# Altium schematic sheet Z7_BANK_DDR3.SchDoc
size A3
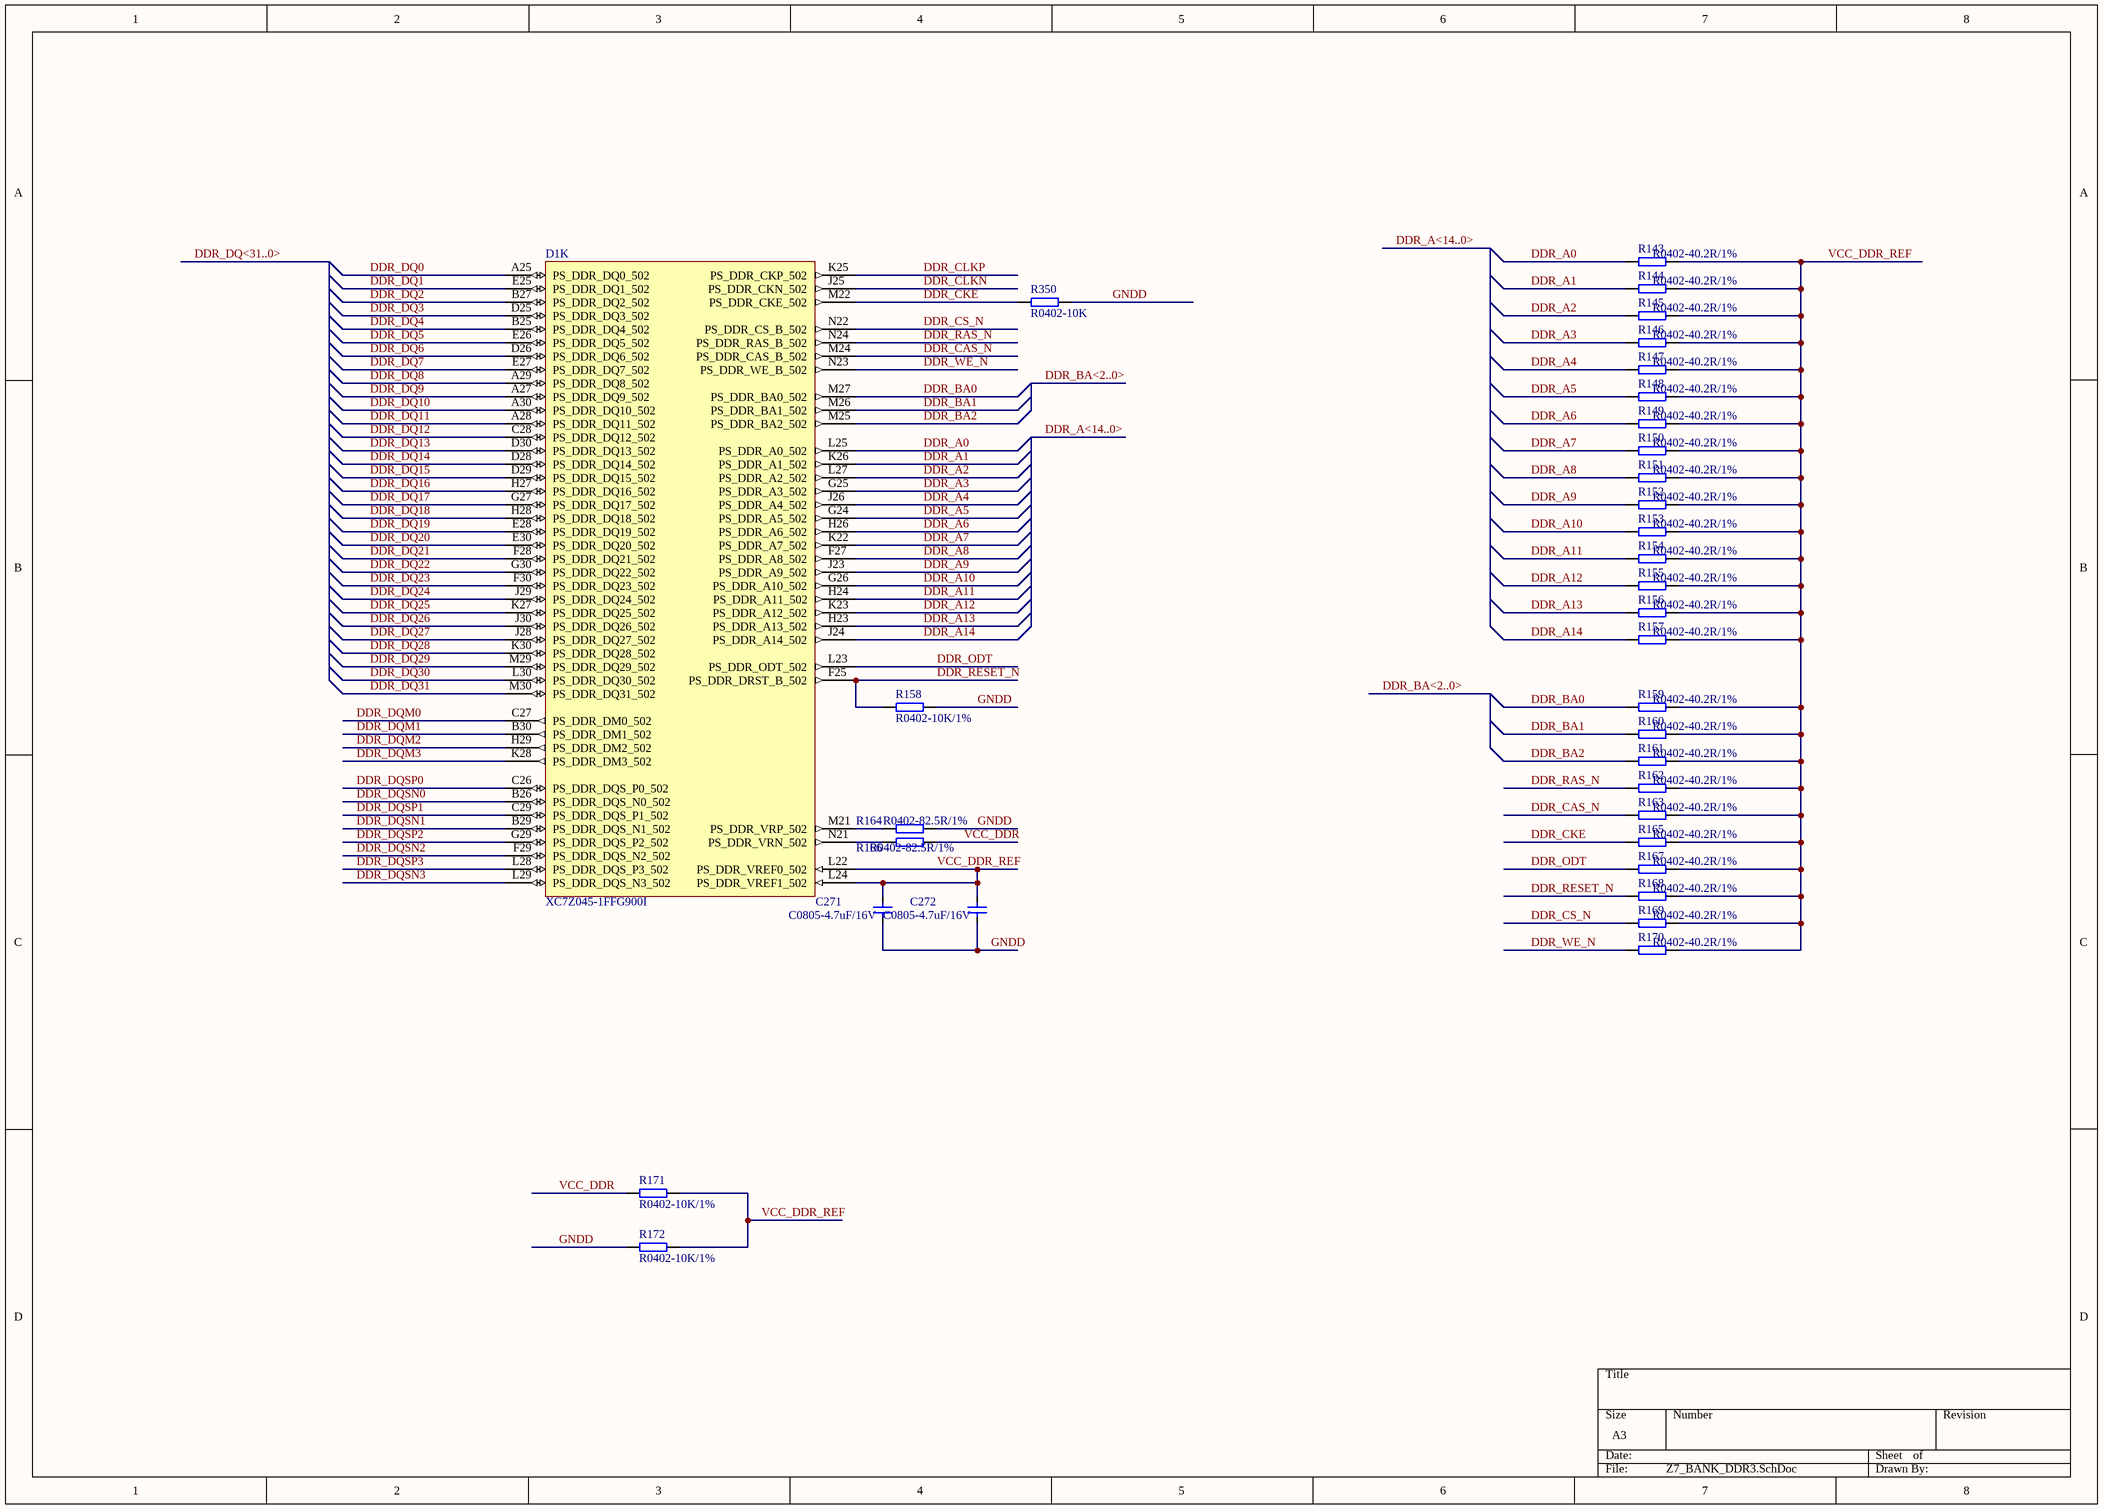
[diagram p0: Z7_BANK_DDR3.SchDoc]

## Parts
C271  C0805-4.7uF/16V  [C0805]
C272  C0805-4.7uF/16V  [C0805]
D1  XC7Z045-1FFG900I  [FFG900]  (part K of 16)
R143  R0402-40.2R/1%  [R0402]
R144  R0402-40.2R/1%  [R0402]
R145  R0402-40.2R/1%  [R0402]
R146  R0402-40.2R/1%  [R0402]
R147  R0402-40.2R/1%  [R0402]
R148  R0402-40.2R/1%  [R0402]
R149  R0402-40.2R/1%  [R0402]
R150  R0402-40.2R/1%  [R0402]
R151  R0402-40.2R/1%  [R0402]
R152  R0402-40.2R/1%  [R0402]
R153  R0402-40.2R/1%  [R0402]
R154  R0402-40.2R/1%  [R0402]
R155  R0402-40.2R/1%  [R0402]
R156  R0402-40.2R/1%  [R0402]
R157  R0402-40.2R/1%  [R0402]
R158  R0402-10K/1%  [R0402]
R159  R0402-40.2R/1%  [R0402]
R160  R0402-40.2R/1%  [R0402]
R161  R0402-40.2R/1%  [R0402]
R162  R0402-40.2R/1%  [R0402]
R163  R0402-40.2R/1%  [R0402]
R164  R0402-82.5R/1%  [R0402]
R165  R0402-40.2R/1%  [R0402]
R166  R0402-82.5R/1%  [R0402]
R167  R0402-40.2R/1%  [R0402]
R168  R0402-40.2R/1%  [R0402]
R169  R0402-40.2R/1%  [R0402]
R170  R0402-40.2R/1%  [R0402]
R171  R0402-10K/1%  [R0402]
R172  R0402-10K/1%  [R0402]
R350  R0402-10K  [R0402]

## Nets
DDR_A0: D1.L25(PS_DDR_A0_502) R143.1
DDR_A1: D1.K26(PS_DDR_A1_502) R144.1
DDR_A2: D1.L27(PS_DDR_A2_502) R145.1
DDR_A3: D1.G25(PS_DDR_A3_502) R146.1
DDR_A4: D1.J26(PS_DDR_A4_502) R147.1
DDR_A5: D1.G24(PS_DDR_A5_502) R148.1
DDR_A6: D1.H26(PS_DDR_A6_502) R149.1
DDR_A7: D1.K22(PS_DDR_A7_502) R150.1
DDR_A8: D1.F27(PS_DDR_A8_502) R151.1
DDR_A9: D1.J23(PS_DDR_A9_502) R152.1
DDR_A10: D1.G26(PS_DDR_A10_502) R153.1
DDR_A11: D1.H24(PS_DDR_A11_502) R154.1
DDR_A12: D1.K23(PS_DDR_A12_502) R155.1
DDR_A13: D1.H23(PS_DDR_A13_502) R156.1
DDR_A14: D1.J24(PS_DDR_A14_502) R157.1
DDR_BA0: D1.M27(PS_DDR_BA0_502) R159.1
DDR_BA1: D1.M26(PS_DDR_BA1_502) R160.1
DDR_BA2: D1.M25(PS_DDR_BA2_502) R161.1
DDR_CAS_N: D1.M24(PS_DDR_CAS_B_502) R163.1
DDR_CKE: D1.M22(PS_DDR_CKE_502) R165.1 R350.2
DDR_CLKN: D1.J25(PS_DDR_CKN_502)
DDR_CLKP: D1.K25(PS_DDR_CKP_502)
DDR_CS_N: D1.N22(PS_DDR_CS_B_502) R169.1
DDR_DQ0: D1.A25(PS_DDR_DQ0_502)
DDR_DQ1: D1.E25(PS_DDR_DQ1_502)
DDR_DQ2: D1.B27(PS_DDR_DQ2_502)
DDR_DQ3: D1.D25(PS_DDR_DQ3_502)
DDR_DQ4: D1.B25(PS_DDR_DQ4_502)
DDR_DQ5: D1.E26(PS_DDR_DQ5_502)
DDR_DQ6: D1.D26(PS_DDR_DQ6_502)
DDR_DQ7: D1.E27(PS_DDR_DQ7_502)
DDR_DQ8: D1.A29(PS_DDR_DQ8_502)
DDR_DQ9: D1.A27(PS_DDR_DQ9_502)
DDR_DQ10: D1.A30(PS_DDR_DQ10_502)
DDR_DQ11: D1.A28(PS_DDR_DQ11_502)
DDR_DQ12: D1.C28(PS_DDR_DQ12_502)
DDR_DQ13: D1.D30(PS_DDR_DQ13_502)
DDR_DQ14: D1.D28(PS_DDR_DQ14_502)
DDR_DQ15: D1.D29(PS_DDR_DQ15_502)
DDR_DQ16: D1.H27(PS_DDR_DQ16_502)
DDR_DQ17: D1.G27(PS_DDR_DQ17_502)
DDR_DQ18: D1.H28(PS_DDR_DQ18_502)
DDR_DQ19: D1.E28(PS_DDR_DQ19_502)
DDR_DQ20: D1.E30(PS_DDR_DQ20_502)
DDR_DQ21: D1.F28(PS_DDR_DQ21_502)
DDR_DQ22: D1.G30(PS_DDR_DQ22_502)
DDR_DQ23: D1.F30(PS_DDR_DQ23_502)
DDR_DQ24: D1.J29(PS_DDR_DQ24_502)
DDR_DQ25: D1.K27(PS_DDR_DQ25_502)
DDR_DQ26: D1.J30(PS_DDR_DQ26_502)
DDR_DQ27: D1.J28(PS_DDR_DQ27_502)
DDR_DQ28: D1.K30(PS_DDR_DQ28_502)
DDR_DQ29: D1.M29(PS_DDR_DQ29_502)
DDR_DQ30: D1.L30(PS_DDR_DQ30_502)
DDR_DQ31: D1.M30(PS_DDR_DQ31_502)
DDR_DQM0: D1.C27(PS_DDR_DM0_502)
DDR_DQM1: D1.B30(PS_DDR_DM1_502)
DDR_DQM2: D1.H29(PS_DDR_DM2_502)
DDR_DQM3: D1.K28(PS_DDR_DM3_502)
DDR_DQSN0: D1.B26(PS_DDR_DQS_N0_502)
DDR_DQSN1: D1.B29(PS_DDR_DQS_N1_502)
DDR_DQSN2: D1.F29(PS_DDR_DQS_N2_502)
DDR_DQSN3: D1.L29(PS_DDR_DQS_N3_502)
DDR_DQSP0: D1.C26(PS_DDR_DQS_P0_502)
DDR_DQSP1: D1.C29(PS_DDR_DQS_P1_502)
DDR_DQSP2: D1.G29(PS_DDR_DQS_P2_502)
DDR_DQSP3: D1.L28(PS_DDR_DQS_P3_502)
DDR_ODT: D1.L23(PS_DDR_ODT_502) R167.1
DDR_RAS_N: D1.N24(PS_DDR_RAS_B_502) R162.1
DDR_RESET_N: D1.F25(PS_DDR_DRST_B_502) R158.2 R168.1
DDR_WE_N: D1.N23(PS_DDR_WE_B_502) R170.1
GNDD: C271.2 C272.2 R158.1 R164.1 R172.2 R350.1
VCC_DDR: R166.1 R171.2
VCC_DDR_REF: C271.1 C272.1 D1.L22(PS_DDR_VREF0_502) D1.L24(PS_DDR_VREF1_502) R143.2 R144.2 R145.2 R146.2 R147.2 R148.2 R149.2 R150.2 R151.2 R152.2 R153.2 R154.2 R155.2 R156.2 R157.2 R159.2 R160.2 R161.2 R162.2 R163.2 R165.2 R167.2 R168.2 R169.2 R170.2 R171.1 R172.1
NetD1_M21: D1.M21(PS_DDR_VRP_502) R164.2
NetD1_N21: D1.N21(PS_DDR_VRN_502) R166.2

## Buses and harness runs
bus DDR_A<14..0>
bus DDR_BA<2..0>
bus DDR_DQ<31..0>

## Library data of the parts
C271 C272 = C0805-4.7uF/50V: X7R; Manufacturer: SAMSUNG; Part_number: C0805-4.7uF/16V; Part_type: CAP; Value: C0805-4.7uF/16V; Schematic_Part: CAP; PCB_Footprint: C0805; datasheet: #DataSheet\C_Samsung_General Capacitors.pdf#
D1 = XC7Z045-1FFG900I: 667 MHz Zynq?7000 AP SoC, 130 PS I/O, 378 FPGA I/O, 900-Ball BGA, Speed Grade 1, Industrial Grade, Pb-Free; Manufacturer: Xilinx; Extensible Block RAM (# 36Kb Blocks): 2180 KB (545); Flip Flops: 437200; LUTs: 218600; Speed Grade: -1; DatasheetVersion: v1.2; PackageVersion: Rev 1.1; PackageReference: FFG900; PackageDescription: Flip-Chip BGA, Body 31 x 31 mm, 1.0 mm Pitch; Generic Part Number: XC7Z045; RoHS: Pb-Free; Mounting Technology: Surface Mount; Code_JEDEC: MS-034-AAN-1; PartNumber: XC7Z045-1FFG900I; ComponentLink1Description: Datasheet; ComponentLink1URL: http://www.xilinx.com/support/documentation/data_sheets/ds190-Zynq-7000-Overview.pdf; ComponentLink2Description: Package Specification; ComponentLink2URL: http://www.xilinx.com/support/documentation/user_guides/ug865-Zynq-7000-Pkg-Pinout.pdf; ComponentLink3Description: DC and AC Switching Characteristics; ComponentLink3URL: http://www.xilinx.com/support/documentation/data_sheets/ds191-XC7Z030-XC7Z045-data-sheet.pdf; ComponentLink4Description: Package File; ComponentLink4URL: http://www.xilinx.com/support/packagefiles/z7packages/xc7z045ffg900pkg.txt; ComponentLink5Description: Packaging and Pinout; ComponentLink5URL: http://www.xilinx.com/support/documentation/user_guides/ug865-Zynq-7000-Pkg-Pinout.pdf; ComponentLink6Description: PCB and Layout Guide; ComponentLink6URL: http://www.xilinx.com/support/documentation/user_guides/ug483_7Series_PCB.pdf
R143-R157 R159-R163 R165 R167-R170 = R0603-40.2R/1%: Manufacturer: SAMSUNG; PCB_Footprint: R0603; Part_number: R0402-40.2R/1%; Part_type: RES; Value: R0402-40.2R/1%; Schematic_Part: RES
R158 R164 R166 R171 R172 R350 = R0402-10K: Manufacturer: SAMSUNG; Part_type: RES; Schematic_Part: RES; PCB_Footprint: R0402
  R158 R171 R172: Part_number: R0402-10K/1%; Value: R0402-10K/1%
  R164 R166: Part_number: R0402-82.5R/1%; Value: R0402-82.5R/1%
  R350: Part_number: R0402-10K; Value: R0402-10K